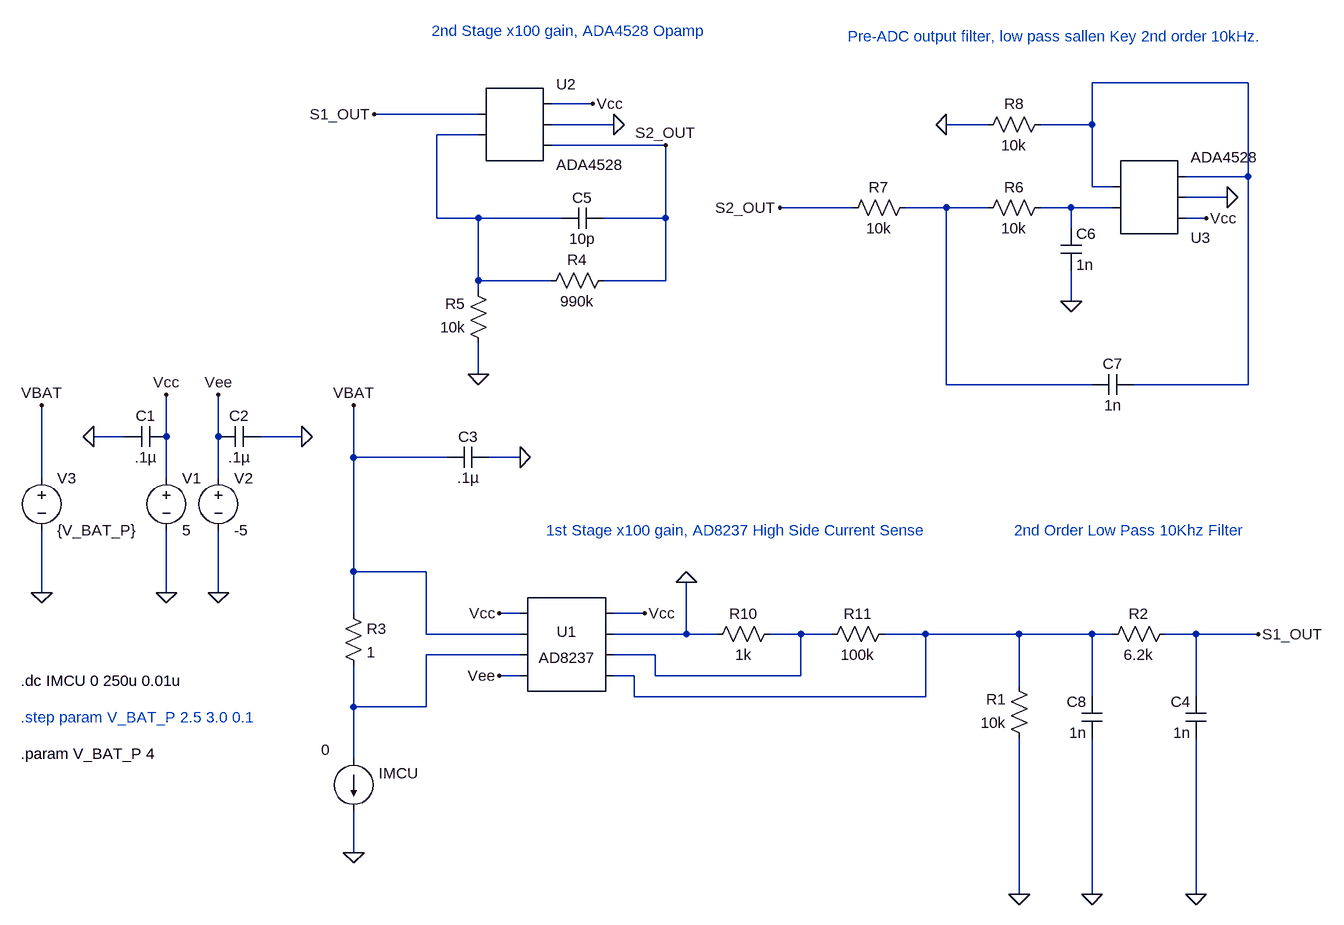
[diagram p0: schematic cm_ad8237_ada4528_A.asc]
cm_ad8237_ada4528_A.asc, the LTspice schematic file:
Version 4
SHEET 1 2532 980
WIRE 1280 -1296 1040 -1296
WIRE 272 -1264 208 -1264
WIRE 96 -1248 -64 -1248
WIRE 304 -1232 208 -1232
WIRE 880 -1232 816 -1232
WIRE 1040 -1232 1040 -1296
WIRE 1040 -1232 960 -1232
WIRE 96 -1216 32 -1216
WIRE 384 -1200 208 -1200
WIRE 1280 -1152 1280 -1296
WIRE 1280 -1152 1184 -1152
WIRE 1040 -1136 1040 -1232
WIRE 1072 -1136 1040 -1136
WIRE 1248 -1120 1184 -1120
WIRE 672 -1104 560 -1104
WIRE 816 -1104 752 -1104
WIRE 880 -1104 816 -1104
WIRE 1008 -1104 960 -1104
WIRE 1072 -1104 1008 -1104
WIRE 32 -1088 32 -1216
WIRE 96 -1088 32 -1088
WIRE 224 -1088 96 -1088
WIRE 384 -1088 384 -1200
WIRE 384 -1088 288 -1088
WIRE 1216 -1088 1184 -1088
WIRE 1008 -1072 1008 -1104
WIRE 96 -992 96 -1088
WIRE 208 -992 96 -992
WIRE 384 -992 384 -1088
WIRE 384 -992 288 -992
WIRE 96 -976 96 -992
WIRE 1008 -960 1008 -1008
WIRE 96 -848 96 -896
WIRE 816 -832 816 -1104
WIRE 1040 -832 816 -832
WIRE 1280 -832 1280 -1152
WIRE 1280 -832 1104 -832
WIRE -448 -752 -496 -752
WIRE -384 -752 -384 -816
WIRE -304 -752 -304 -816
WIRE -176 -752 -240 -752
WIRE -96 -720 -96 -800
WIRE 48 -720 -96 -720
WIRE 160 -720 112 -720
WIRE -576 -688 -576 -800
WIRE -384 -688 -384 -752
WIRE -304 -688 -304 -752
WIRE -96 -544 -96 -720
WIRE 16 -544 -96 -544
WIRE -576 -512 -576 -608
WIRE -384 -512 -384 -608
WIRE -304 -512 -304 -608
WIRE -96 -480 -96 -544
WIRE 160 -480 128 -480
WIRE 352 -480 304 -480
WIRE 16 -448 16 -544
WIRE 160 -448 16 -448
WIRE 416 -448 416 -528
WIRE 416 -448 304 -448
WIRE 464 -448 416 -448
WIRE 592 -448 544 -448
WIRE 640 -448 592 -448
WIRE 784 -448 720 -448
WIRE 928 -448 784 -448
WIRE 1040 -448 928 -448
WIRE 1072 -448 1040 -448
WIRE 1200 -448 1152 -448
WIRE 1296 -448 1200 -448
WIRE 160 -416 16 -416
WIRE 368 -416 304 -416
WIRE 160 -384 128 -384
WIRE 336 -384 304 -384
WIRE 368 -384 368 -416
WIRE 592 -384 592 -448
WIRE 592 -384 368 -384
WIRE 928 -368 928 -448
WIRE 336 -352 336 -384
WIRE 784 -352 784 -448
WIRE 784 -352 336 -352
WIRE 1040 -352 1040 -448
WIRE 1200 -352 1200 -448
WIRE -96 -336 -96 -400
WIRE 16 -336 16 -416
WIRE 16 -336 -96 -336
WIRE -96 -256 -96 -336
WIRE -96 -112 -96 -176
WIRE 928 -48 928 -288
WIRE 1040 -48 1040 -288
WIRE 1200 -48 1200 -288
FLAG -384 -512 0
FLAG -384 -816 Vcc
FLAG 160 -720 0
FLAG -576 -512 0
FLAG -576 -800 VBAT
FLAG -96 -800 VBAT
FLAG -96 -112 0
FLAG 352 -480 Vcc
FLAG -304 -512 0
FLAG -304 -816 Vee
FLAG 128 -384 Vee
FLAG 416 -528 0
FLAG 128 -480 Vcc
FLAG -496 -752 0
FLAG -176 -752 0
FLAG 928 -48 0
FLAG 272 -1264 Vcc
FLAG 304 -1232 0
FLAG 96 -848 0
FLAG 1200 -48 0
FLAG -64 -1248 S1_OUT
FLAG 1216 -1088 Vcc
FLAG 1008 -960 0
FLAG 816 -1232 0
FLAG 1248 -1120 0
FLAG 384 -1200 S2_OUT
FLAG 1040 -48 0
FLAG 1296 -448 S1_OUT
FLAG 560 -1104 S2_OUT
SYMBOL voltage -384 -704 R0
WINDOW 123 0 0 Left 2
WINDOW 39 0 0 Left 2
SYMATTR InstName V1
SYMATTR Value 5
SYMBOL cap 48 -704 R270
WINDOW 0 32 32 VTop 2
WINDOW 3 0 32 VBottom 2
SYMATTR InstName C3
SYMATTR Value .1µ
SYMBOL voltage -576 -704 R0
WINDOW 123 0 0 Left 2
WINDOW 39 0 0 Left 2
SYMATTR InstName V3
SYMATTR Value {V_BAT_P}
SYMBOL res -112 -496 R0
SYMATTR InstName R3
SYMATTR Value 1
SYMATTR SpiceLine tol=0.01 pwr=100m
SYMBOL current -96 -256 R0
WINDOW 123 47 58 Left 2
WINDOW 39 0 0 Left 2
WINDOW 3 -50 -14 Left 2
WINDOW 0 39 22 Left 2
SYMATTR Value 0
SYMATTR InstName IMCU
SYMBOL AutoGenerated\\AD8237 224 -432 R0
SYMATTR InstName U1
SYMBOL voltage -304 -704 R0
WINDOW 123 0 0 Left 2
WINDOW 39 0 0 Left 2
SYMATTR InstName V2
SYMATTR Value -5
SYMBOL res 448 -432 R270
WINDOW 0 32 56 VTop 2
WINDOW 3 0 56 VBottom 2
SYMATTR InstName R10
SYMATTR Value 1k
SYMBOL res 624 -432 R270
WINDOW 0 32 56 VTop 2
WINDOW 3 0 56 VBottom 2
SYMATTR InstName R11
SYMATTR Value 100k
SYMBOL cap -384 -768 R90
WINDOW 0 0 32 VBottom 2
WINDOW 3 32 32 VTop 2
SYMATTR InstName C1
SYMATTR Value .1µ
SYMBOL cap -240 -768 R90
WINDOW 0 0 32 VBottom 2
WINDOW 3 32 32 VTop 2
SYMATTR InstName C2
SYMATTR Value .1µ
SYMBOL res 944 -272 R180
WINDOW 0 36 76 Left 2
WINDOW 3 36 40 Left 2
SYMATTR InstName R1
SYMATTR Value 10k
SYMATTR SpiceLine tol=.1
SYMBOL res 1168 -464 R90
WINDOW 0 0 56 VBottom 2
WINDOW 3 32 56 VTop 2
SYMATTR InstName R2
SYMATTR Value 6.2k
SYMBOL cap 1216 -288 R180
WINDOW 0 24 56 Left 2
WINDOW 3 24 8 Left 2
SYMATTR InstName C4
SYMATTR Value 1n
SYMBOL cap 224 -1072 R270
WINDOW 0 32 32 VTop 2
WINDOW 3 0 32 VBottom 2
SYMATTR InstName C5
SYMATTR Value 10p
SYMBOL res 304 -1008 R90
WINDOW 0 0 56 VBottom 2
WINDOW 3 32 56 VTop 2
SYMATTR InstName R4
SYMATTR Value 990k
SYMBOL res 112 -880 R180
WINDOW 0 36 76 Left 2
WINDOW 3 36 40 Left 2
SYMATTR InstName R5
SYMATTR Value 10k
SYMBOL res 976 -1120 R90
WINDOW 0 0 56 VBottom 2
WINDOW 3 32 56 VTop 2
SYMATTR InstName R6
SYMATTR Value 10k
SYMBOL res 768 -1120 R90
WINDOW 0 0 56 VBottom 2
WINDOW 3 32 56 VTop 2
SYMATTR InstName R7
SYMATTR Value 10k
SYMBOL cap 992 -1072 R0
SYMATTR InstName C6
SYMATTR Value 1n
SYMBOL cap 1104 -848 R90
WINDOW 0 0 32 VBottom 2
WINDOW 3 32 32 VTop 2
SYMATTR InstName C7
SYMATTR Value 1n
SYMBOL res 976 -1248 R90
WINDOW 0 0 56 VBottom 2
WINDOW 3 32 56 VTop 2
SYMATTR InstName R8
SYMATTR Value 10k
SYMBOL cap 1056 -288 R180
WINDOW 0 24 56 Left 2
WINDOW 3 24 8 Left 2
SYMATTR InstName C8
SYMATTR Value 1n
SYMBOL AutoGenerated\\ADA4528 160 -1232 R0
SYMATTR InstName U2
SYMBOL AutoGenerated\\ADA4528 1136 -1120 M180
SYMATTR InstName U3
TEXT -608 -320 Left 2 ;.step param V_BAT_P 2.5 3.0 0.1
TEXT -608 -264 Left 2 !.param V_BAT_P 4
TEXT -608 -376 Left 2 !.dc IMCU 0 250u 0.01u
TEXT 200 -608 Left 2 ;1st Stage x100 gain, AD8237 High Side Current Sense
TEXT 24 -1376 Left 2 ;2nd Stage x100 gain, ADA4528 Opamp
TEXT 664 -1368 Left 2 ;Pre-ADC output filter, low pass sallen Key 2nd order 10kHz.
TEXT 920 -608 Left 2 ;2nd Order Low Pass 10Khz Filter

The netlist it stands for:
* cm_ad8237_ada4528_A.asc
V1 Vcc 0 5
C3 VBAT 0 .1µ
V3 VBAT 0 {V_BAT_P}
R3 VBAT N007 1 tol=0.01 pwr=100m
IMCU N007 0 0
* U1: AD8237 (symbol AutoGenerated\AD8237 not available, pins judged from their places): pin1=Vcc pin2=VBAT pin3=N007 pin4=Vee pin5=Vcc pin6=0 pin7=N005 pin8=N006
V2 Vee 0 -5
R10 0 N005 1k
R11 N005 N006 100k
C1 Vcc 0 .1µ
C2 0 Vee .1µ
R1 0 N006 10k tol=.1
R2 S1_OUT N006 6.2k
C4 0 S1_OUT 1n
C5 N002 S2_OUT 10p
R4 S2_OUT N002 990k
R5 0 N002 10k
R6 N004 N003 10k
R7 N003 S2_OUT 10k
C6 N004 0 1n
C7 N001 N003 1n
R8 N001 0 10k
C8 0 N006 1n
* U2: ADA4528 (symbol AutoGenerated\ADA4528 not available, pins judged from their places): pin1=S1_OUT pin2=N002 pin3=Vcc pin4=0 pin5=S2_OUT
* U3: ADA4528 (symbol AutoGenerated\ADA4528 not available, pins judged from their places): pin1=N004 pin2=N001 pin3=Vcc pin4=0 pin5=N001
* .step param V_BAT_P 2.5 3.0 0.1
.param V_BAT_P 4
.dc IMCU 0 250u 0.01u
* 1st Stage x100 gain, AD8237 High Side Current Sense
* 2nd Stage x100 gain, ADA4528 Opamp
* Pre-ADC output filter, low pass sallen Key 2nd order 10kHz.
* 2nd Order Low Pass 10Khz Filter
.backanno
.end